# EAGLE design Pushbutton v1.0 (EAGLE 7.7.0)
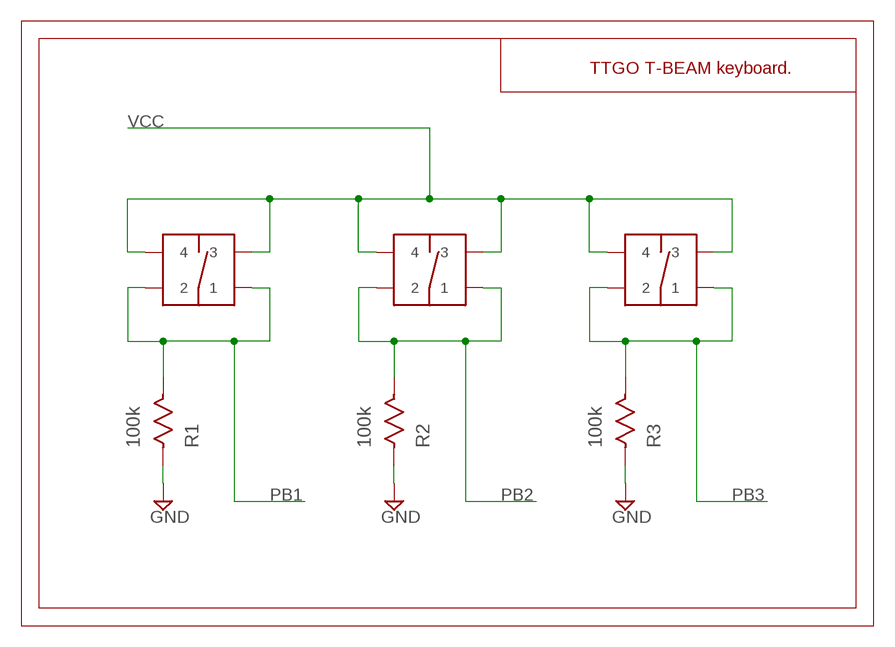
[diagram p0: schematic, sheet 1]

## Parts
B1  PUSHBUTTON_1  [PUSHBUTTON_1]
B2  PUSHBUTTON_1  [PUSHBUTTON_1]
B3  PUSHBUTTON_1  [PUSHBUTTON_1]
R1  100k  RES0402  [RES0402]
R2  100k  RES0402  [RES0402]
R3  100k  RES0402  [RES0402]

## Nets
GND: R1.P$1 R2.P$1 R3.P$1
PB1: B1.1 B1.2 R1.P$2
PB2: B2.1 B2.2 R2.P$2
PB3: B3.1 B3.2 R3.P$2
VCC: B1.3 B1.4 B2.3 B2.4 B3.3 B3.4

## Notes on the sheet
- TTGO T-BEAM keyboard.

## Library data of the parts
B1-B3 = TT7:PUSHBUTTON_1: Through-hole pushbutton footprint.
R1-R3 = TT7:RES0402: RESISTOR 0402 - 1 x 0.5 x 0.35mm

## Board
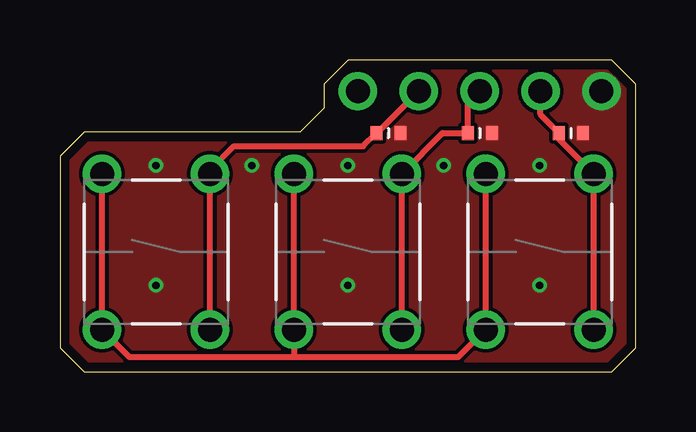
[diagram p1: board, top side]
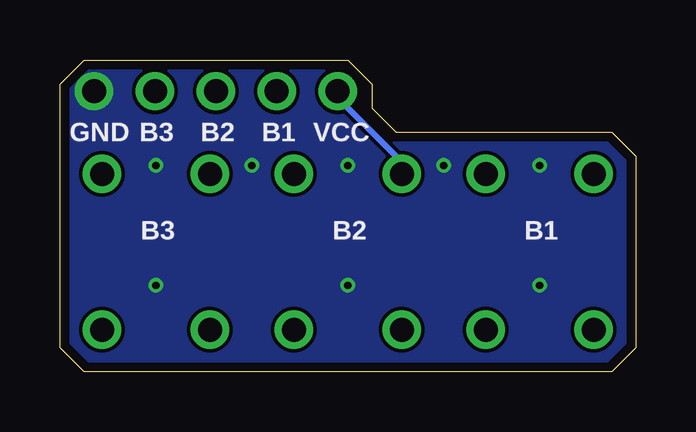
[diagram p2: board, bottom side, seen from below]

Size 24 x 13 mm. Coordinates in mm from the lower left corner, seen from the top.
Outline: 1,0 23,0 24,1 24,12 23,13 12,13 11,12 11,11 10,10 1,10 0,9 0,1 1,0
Copper layers (1*16): Top 0.035559375mm / dielectric 1.6mm / Bottom 0.035559375mm
Design rules "oshpark-2layer *": minimum track width 6mil, minimum drill 10mil, track to track 6mil, track to pad 6mil, pad to pad 6mil, via to via 6mil, smd to smd 6mil, copper to edge 15mil, drill to drill 6mil, minimum pad ring 5mil, minimum via ring 5mil, stop-mask expansion 2.5mil, vias tented up to drill 22mil, thermal gap 10mil

### Footprints (pad centres in the part's own frame; a part is rotated, then mirrored left to right if it is on the bottom)
PUSHBUTTON_1 = drill 1 pad 1.6: 1 3.25,-2.25; 2 -3.25,-2.25; 3 3.25,2.25; 4 -3.25,2.25
RES0402 = smd 0.5 x 0.6: P$1 -0.5,0; P$2 0.5,0

### Placement (x,y rotation side)
B1  4,5 90 top
B2  12,5 90 top
B3  20,5 90 top
R1  13.69,9.95 180 top
R2  17.5,9.95 180 top
R3  21.31,9.95 180 top

### Tracks (layer width: path | path; a pad name or v marks a point on that pad's centre or on a via)
GND  (via drill 0.3 pad 0.6, 1 pad 1.6)
  other vias: 22.58,11.7 8,8.6 12,8.6 16,8.6 20,8.6 4,8.6 12,3.6 20,3.6 4,3.6
  pour Top (rank 2, no thermals): 0,0 24,0 24,13 0,13
  pour Bottom (rank 2, no thermals): 0,13 24,13 24,0 0,0
PB1  (via drill 1 pad 1.6)
  Top 0.254: B1.2 B1.1 6.25,8.41 7.24,9.4 12.64,9.4 R1.P$2 13.21,9.95 v14.96,11.7
PB2  (via drill 1 pad 1.6)
  Top 0.254: B2.2 B2.1 15.95,9.95 R2.P$2 17,11.2 v17.5,11.7
PB3  (via drill 1 pad 1.6)
  Top 0.254: B3.2 B3.1 20.81,9.69 R3.P$2 20.04,10.72 v20.04,11.7
VCC  (via drill 1 pad 1.6)
  Top 0.254: B1.3 B1.4 2.9,0.6 9.75,0.6 | B2.3 B2.4 9.75,0.6 | B3.3 B3.4 16.6,0.6 9.75,0.6
  Bottom 0.254: B2.3 9.75,8.75 12.42,11.42 v12.42,11.7

### Text on the board
bPlace: VCC | B1 | B2 | B3 | GND | B1 | B2 | B3